# EAGLE design logger (EAGLE 9.6.2)
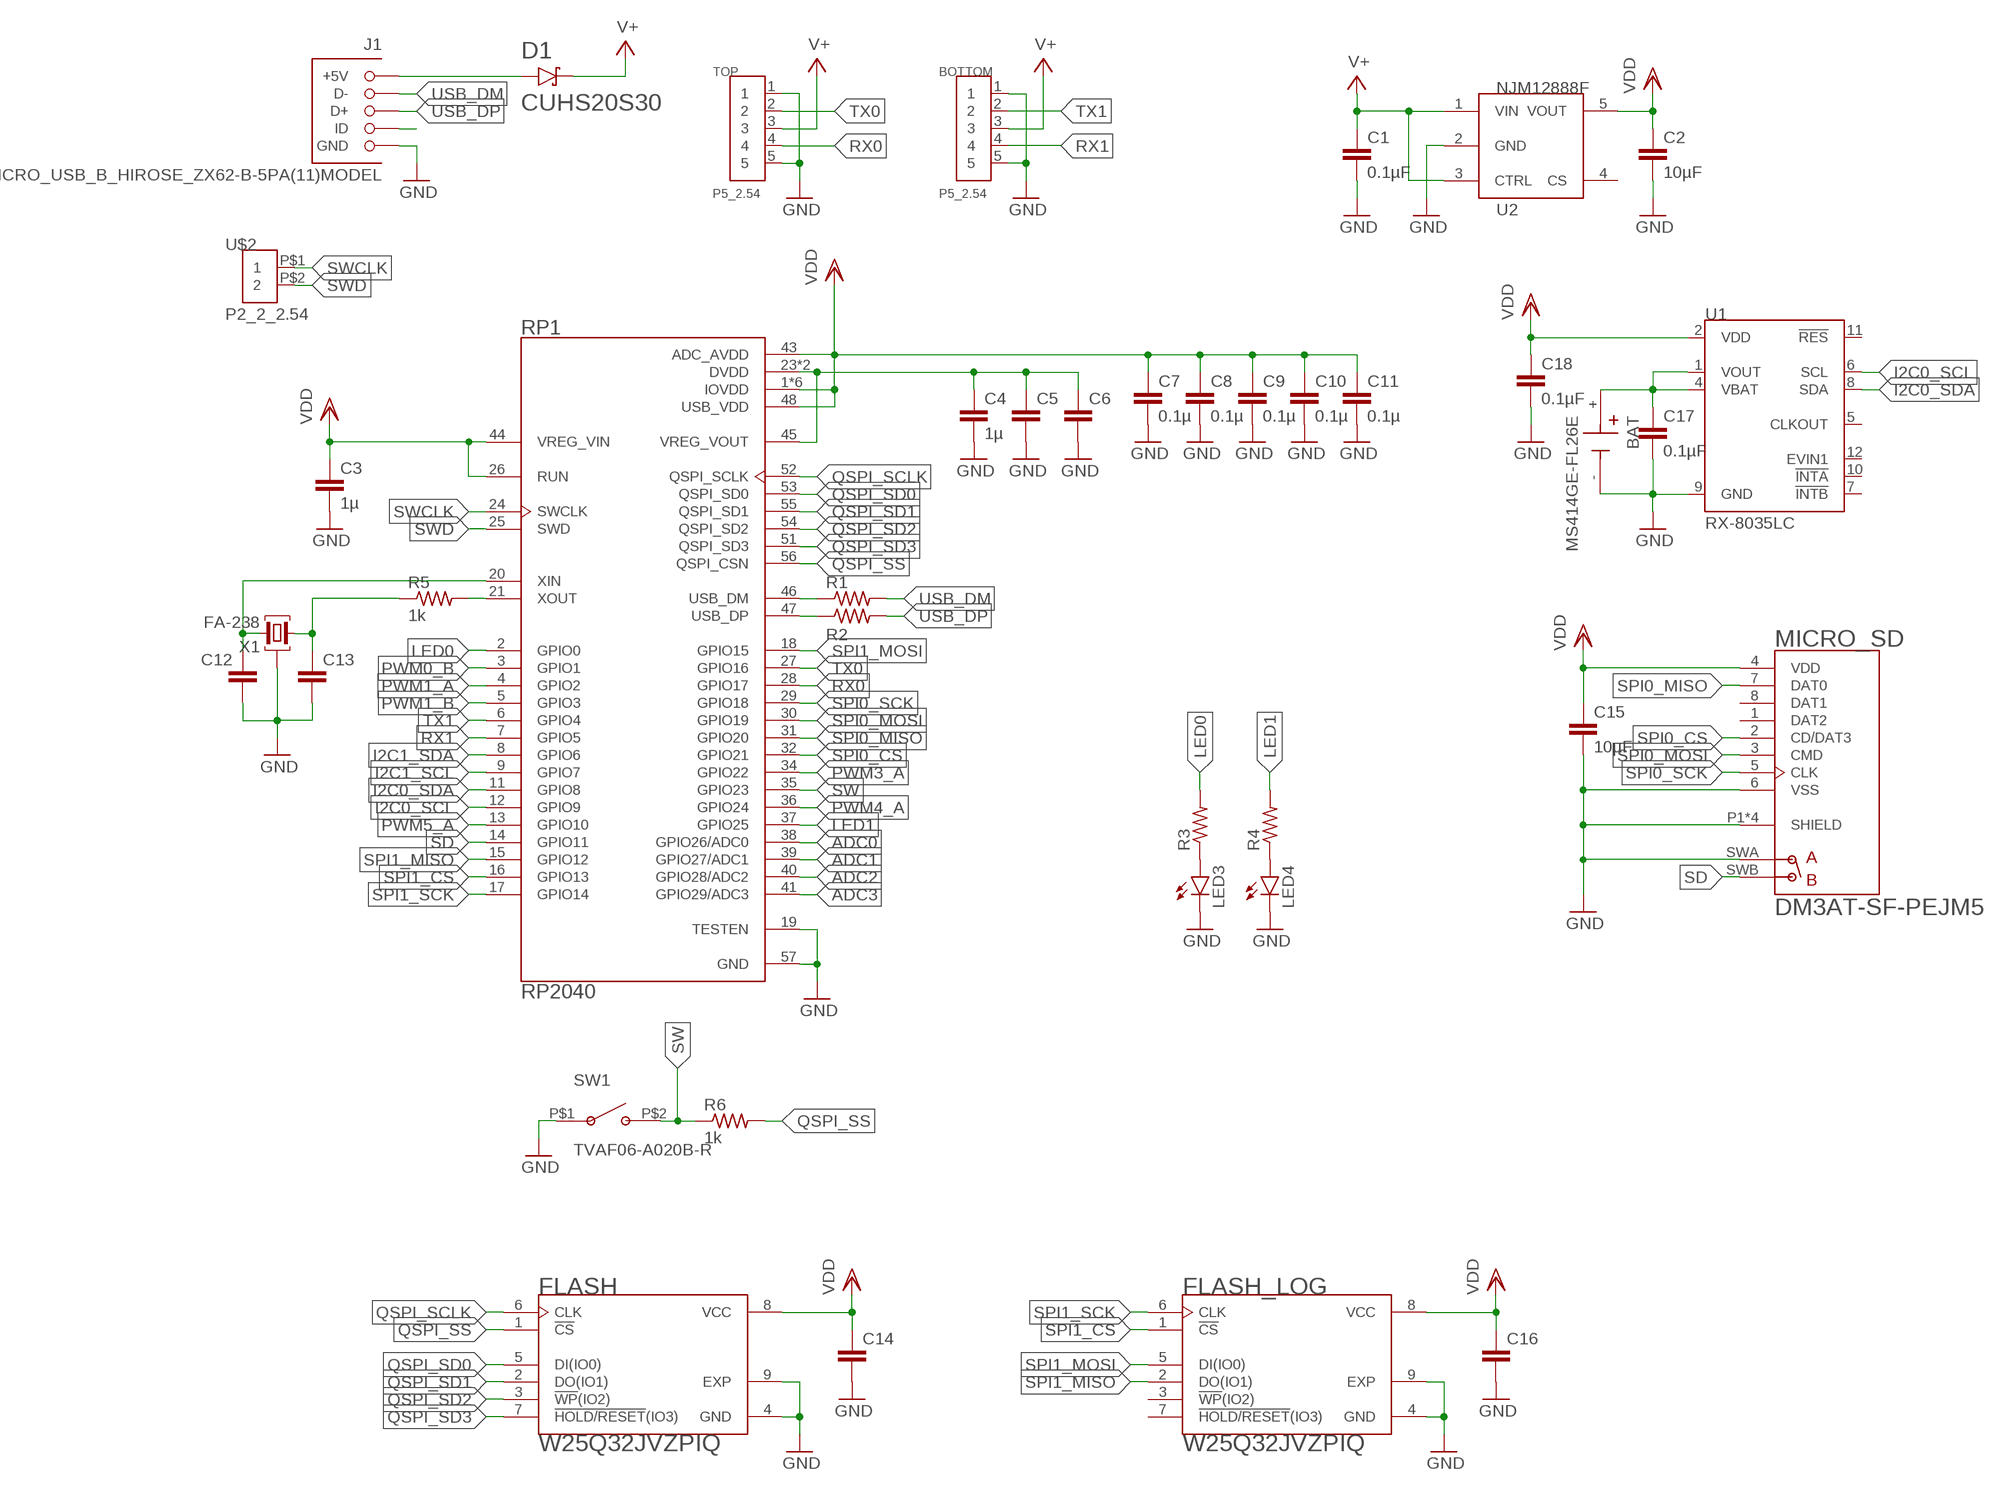
[diagram p0: schematic, sheet 1]

## Parts
BAT  MS414GE-FL26E  [BAT_MS414GE-FL26E]
BOTTOM  P5_2.54  [P5_2.54]
C1  0.1µF  C-EUC0402  [C0402]
C2  10µF  C-EUC0402  [C0402]
C3  1µ  C-EUC0402  [C0402]
C4  1µ  C-EUC0402  [C0402]
C5  C-EUC0402  [C0402]
C6  C-EUC0402  [C0402]
C7  0.1µ  C-EUC0402  [C0402]
C8  0.1µ  C-EUC0402  [C0402]
C9  0.1µ  C-EUC0402  [C0402]
C10  0.1µ  C-EUC0402  [C0402]
C11  0.1µ  C-EUC0402  [C0402]
C12  C-EUC0402  [C0402]
C13  C-EUC0402  [C0402]
C14  C-EUC0402  [C0402]
C15  10µF  C-EUC0402  [C0402]
C16  C-EUC0402  [C0402]
C17  0.1µF  C-EUC0402  [C0402]
C18  0.1µF  C-EUC0402  [C0402]
D1  CUHS20S30  [CUHS20S30]
FLASH  W25Q32JVZPIQ  [SON127P600X500X80-9N]
FLASH_LOG  W25Q32JVZPIQ  [SON127P600X500X80-9N]
J1  MICRO_USB_B_HIROSE_ZX62-B-5PA(11)MODEL  [GHI-CONNECTORS_10118192-0001LF(MICRO-USB-B-AMPHENOL-FCI)]
LED3  LEDCHIPLED_0603  [CHIPLED_0603]
LED4  LEDCHIPLED_0603  [CHIPLED_0603]
MICRO_SD  DM3AT-SF-PEJM5  [HRS_DM3AT-SF-PEJM5]
R1  R-US_R0402  [R0402]
R2  R-US_R0402  [R0402]
R3  R-US_R0402  [R0402]
R4  R-US_R0402  [R0402]
R5  1k  R-US_R0402  [R0402]
R6  1k  R-US_R0402  [R0402]
RP1  RP2040  [QFN40P700X700X90-57N]
SW1  TVAF06-A020B-R  [TVAF06-A020B-R]
TOP  P5_2.54  [P5_2.54]
U1  RX-8035LC  [VSOJ12]
U2  NJM12888F  [SOT95P240X110-5N]
U$2  P2_2_2.54  [P2_2.54]
X1  FA-238  [FA-238]

## Nets
1V2: C4.1 C5.1 C6.1 RP1.23(DVDD) RP1.45(VREG_VOUT) RP1.50(DVDD)
ADC0: RP1.38(GPIO26/ADC0)
ADC1: RP1.39(GPIO27/ADC1)
ADC2: RP1.40(GPIO28/ADC2)
ADC3: RP1.41(GPIO29/ADC3)
GND: BAT.- BOTTOM.1 BOTTOM.5 C1.2 C2.2 C3.2 C4.2 C5.2 C6.2 C7.2 C8.2 C9.2 C10.2 C11.2 C12.2 C13.2 C14.2 C15.2 C16.2 C17.2 C18.2 FLASH.4(GND) FLASH.9(EXP) FLASH_LOG.4(GND) FLASH_LOG.9(EXP) J1.CGND1(GND) J1.CGND2(GND) J1.CGND3(GND) J1.CGND4(GND) J1.CGND5(GND) J1.CGND6(GND) J1.GND LED3.C LED4.C MICRO_SD.6(VSS) MICRO_SD.P1(SHIELD) MICRO_SD.P2(SHIELD) MICRO_SD.P3(SHIELD) MICRO_SD.P4(SHIELD) MICRO_SD.SWA(A) RP1.19(TESTEN) RP1.57(GND) SW1.P$1(A) TOP.1 TOP.5 U1.9(GND) U2.2(GND) X1.2(G) X1.4(G)
I2C0_SCL: RP1.12(GPIO9) U1.6(SCL)
I2C0_SDA: RP1.11(GPIO8) U1.8(SDA)
I2C1_SCL: RP1.9(GPIO7)
I2C1_SDA: RP1.8(GPIO6)
LED0: R3.2 RP1.2(GPIO0)
LED1: R4.2 RP1.37(GPIO25)
N$1: BAT.+ C17.1 U1.1(VOUT) U1.4(VBAT)
N$5: J1.ID
N$6: D1.A J1.VBUS(+5V)
N$8: LED3.A R3.1
N$9: LED4.A R4.1
N$11: C13.1 R5.1 X1.1
PWM0_B: RP1.3(GPIO1)
PWM1_A: RP1.4(GPIO2)
PWM1_B: RP1.5(GPIO3)
PWM3_A: RP1.34(GPIO22)
PWM4_A: RP1.36(GPIO24)
PWM5_A: RP1.13(GPIO10)
QSPI_SCLK: FLASH.6(CLK) RP1.52(QSPI_SCLK)
QSPI_SD0: FLASH.5(DI(IO0)) RP1.53(QSPI_SD0)
QSPI_SD1: FLASH.2(DO(IO1)) RP1.55(QSPI_SD1)
QSPI_SD2: FLASH.3(!WP!(IO2)) RP1.54(QSPI_SD2)
QSPI_SD3: FLASH.7(!HOLD/RESET!(IO3)) RP1.51(QSPI_SD3)
QSPI_SS: FLASH.1(!CS) R6.2 RP1.56(QSPI_CSN)
RX0: RP1.28(GPIO17) TOP.4
RX1: BOTTOM.4 RP1.7(GPIO5)
SD: MICRO_SD.SWB(B) RP1.14(GPIO11)
SPI0_CS: MICRO_SD.2(CD/DAT3) RP1.32(GPIO21)
SPI0_MISO: MICRO_SD.7(DAT0) RP1.31(GPIO20)
SPI0_MOSI: MICRO_SD.3(CMD) RP1.30(GPIO19)
SPI0_SCK: MICRO_SD.5(CLK) RP1.29(GPIO18)
SPI1_CS: FLASH_LOG.1(!CS) RP1.16(GPIO13)
SPI1_MISO: FLASH_LOG.2(DO(IO1)) RP1.15(GPIO12)
SPI1_MOSI: FLASH_LOG.5(DI(IO0)) RP1.18(GPIO15)
SPI1_SCK: FLASH_LOG.6(CLK) RP1.17(GPIO14)
SW: R6.1 RP1.35(GPIO23) SW1.P$2(B)
SWCLK: RP1.24(SWCLK) U$2.P$1
SWD: RP1.25(SWD) U$2.P$2
TX0: RP1.27(GPIO16) TOP.2
TX1: BOTTOM.2 RP1.6(GPIO4)
USB_DM: J1.D- R1.2
USB_DM_1: R1.1 RP1.46(USB_DM)
USB_DP: J1.D+ R2.2
USB_DP_1: R2.1 RP1.47(USB_DP)
V+: BOTTOM.3 C1.1 D1.C TOP.3 U2.1(VIN) U2.3(CTRL)
VDD: C2.1 C3.1 C7.1 C8.1 C9.1 C10.1 C11.1 C14.1 C15.1 C16.1 C18.1 FLASH.8(VCC) FLASH_LOG.8(VCC) MICRO_SD.4(VDD) RP1.1(IOVDD) RP1.10(IOVDD) RP1.22(IOVDD) RP1.26(RUN) RP1.33(IOVDD) RP1.42(IOVDD) RP1.43(ADC_AVDD) RP1.44(VREG_VIN) RP1.48(USB_VDD) RP1.49(IOVDD) U1.2(VDD) U2.5(VOUT)
XIN1: C12.1 RP1.20(XIN) X1.3
XOUT1: R5.2 RP1.21(XOUT)
Unconnected: FLASH_LOG.3(!WP!(IO2)) FLASH_LOG.7(!HOLD/RESET!(IO3)) MICRO_SD.1(DAT2) MICRO_SD.8(DAT1) U1.5(CLKOUT) U1.7(!INTB!) U1.10(!INTA!) U1.11(!RES!) U1.12(EVIN1) U2.4(CS)

## Library data of the parts
BAT = MS414GE-FL26E:MS414GE-FL26E: Coin, 4.8mm 3V Lithium Battery Rechargeable (Secondary) 2mAh Check availability <https://pricing.snapeda.com/parts/MS414GE-FL26E/Seiko/view-part?ref=eda>; AVAILABILITY: In Stock; DESCRIPTION: Coin, 4.8mm 3 V Lithium Battery Rechargeable (Secondary) 2mAh; MF: Seiko; MP: MS414GE-FL26E; PACKAGE: Custom Package Seiko; PRICE: None; PURCHASE-URL: https://pricing.snapeda.com/search/part/MS414GE-FL26E/?ref=eda
BOTTOM TOP = pins:P5_2.54
C1-C18 = rcl:C-EU: CAPACITOR, European symbol; SPICEPREFIX: C
D1 = diodes:CUHS20S30
FLASH FLASH_LOG = W25Q32JVZPIQ:W25Q32JVZPIQ: Serial Flash Memory With Dual, Quad Spi Check availability <https://pricing.snapeda.com/parts/W25Q32JVZPIQ/Winbond/view-part?ref=eda>; AVAILABILITY: In Stock; DESCRIPTION: FLASH - NOR Memory IC 32Mb (4M x 8) SPI - Quad I/O 133 MHz 8-WSON (6x5); MF: Winbond; MP: W25Q32JVZPIQ; PACKAGE: WSON-8 Winbond; PRICE: None; PURCHASE-URL: https://pricing.snapeda.com/search/part/W25Q32JVZPIQ/?ref=eda
J1 = connector:MICRO_USB_B_HIROSE_ZX62-B-5PA(11): Connector Receptacle USB - micro B 2.0 5 Position Surface Mount, Right Angle, Horizontal Bottom Mount
LED3 LED4 = led:LED: LED OSRAM: - CHIPLED LG R971, LG N971, LY N971, LG Q971, LY Q971, LO R971, LY R971 LH N974, LH R974 LS Q976, LO Q976, LY Q976 LO Q996 - Hyper CHIPLED LW Q18S LB Q993, LB Q99A, LB R99A - SideLED LS A670, LO A670, LY A670, LG A670, LP A670 LB A673, LV A673, LT A673, LW A673 LH A674 LY A675 LS A676, LA A676, LO A676, LY A676, LW A676 LS A679, LY A679, LG A679 - Hyper Micro SIDELED® LS Y876, LA Y876, LO Y876, LY Y876 LT Y87S - SmartLED LW L88C, LW L88S LB L89C, LB L89S, LG L890 LS L89K, LO L89K, LY L89K LS L896, LA L896, LO L896, LY L896 - TOPLED LS T670, LO T670, LY T670, LG T670, LP T670 LSG T670, LSP T670, LSY T670, LOP T670, LYG T670 LG T671, LOG T671, LSG T671 LB T673, LV T673, LT T673, LW T673 LH T674 LS T676, LA T676, LO T676, LY T676, LB T676, LH T676, LSB T676, LW T676 LB T67C, LV T67C, LT T67C, LS T67K, LO T67K, LY T67K, LW E67C LS E67B, LA E67B, LO E67B, LY E67B, LB E67C, LV E67C, LT E67C LW T67C LS T679, LY T679, LG T679 LS T770, LO T770, LY T770, LG T770, LP T770 LB T773, LV T773, LT T773, LW T773 LH T774 LS E675, LA E675, LY E675, LS T675 LS T776, LA T776, LO T776, LY T776, LB T776 LHGB T686 LT T68C, LB T68C - Hyper Mini TOPLED® LB M676 - Mini TOPLED Santana® LG M470 LS M47K, LO M47K, LY M47K Source: http://www.osram.convergy.de LUXEON: - LUMILED® LXK2-PW12-R00, LXK2-PW12-S00, LXK2-PW14-U00, LXK2-PW14-V00 LXK2-PM12-R00, LXK2-PM12-S00, LXK2-PM14-U00 LXK2-PE12-Q00, LXK2-PE12-R00, LXK2-PE12-S00, LXK2-PE14-T00, LXK2-PE14-U00 LXK2-PB12-K00, LXK2-PB12-L00, LXK2-PB12-M00, LXK2-PB14-N00, LXK2-PB14-P00, LXK2-PB14-Q00 LXK2-PR12-L00, LXK2-PR12-M00, LXK2-PR14-Q00, LXK2-PR14-R00 LXK2-PD12-Q00, LXK2-PD12-R00, LXK2-PD12-S00 LXK2-PH12-R00, LXK2-PH12-S00 LXK2-PL12-P00, LXK2-PL12-Q00, LXK2-PL12-R00 Source: www.luxeon.com KINGBRIGHT: KA-3528ASYC Source: www.kingbright.com
MICRO_SD = dm3at-sf-pejm5:DM3AT-SF-PEJM5: DM3 Series 8 Position Right Angle SMT Push Push Ejection MicroSD Card Connector; DESCRIPTION: DM3 RA SMT microSD memory card push/push; DIGI-KEY_PART_NUMBER: HR1964CT-ND; DIGI-KEY_PURCHASE_URL: https://www.digikey.jp/product-detail/en/hirose-electric-co-ltd/DM3AT-SF-PEJM5/HR1964CT-ND/2533566?utm_source=snapeda&utm_medium=aggregator&utm_campaign=symbol; MF: Hirose; MP: DM3AT-SF-PEJM5; PACKAGE: None
R1-R6 = rcl:R-US_: RESISTOR, American symbol; SPICEPREFIX: R
RP1 = RP2040:RP2040: Check availability <https://pricing.snapeda.com/parts/RP2040/Raspberry%20Pi/view-part?ref=eda>; AVAILABILITY: In Stock; DESCRIPTION: RP2040 chip for Raspberry Pi Pico - ARM® Cortex®-M0+ MCU 32-Bit; MF: Raspberry Pi; MP: RP2040; PACKAGE: None; PRICE: None; PURCHASE-URL: https://pricing.snapeda.com/search/part/RP2040/?ref=eda
SW1 = switches:TVAF06-A020B-R
U1 = rtc:RX-8035LC
U2 = regulators:NJM12888F
U$2 = pins:P2_2_2.54
X1 = crystal':FA-238: CRYSTAL

## Board
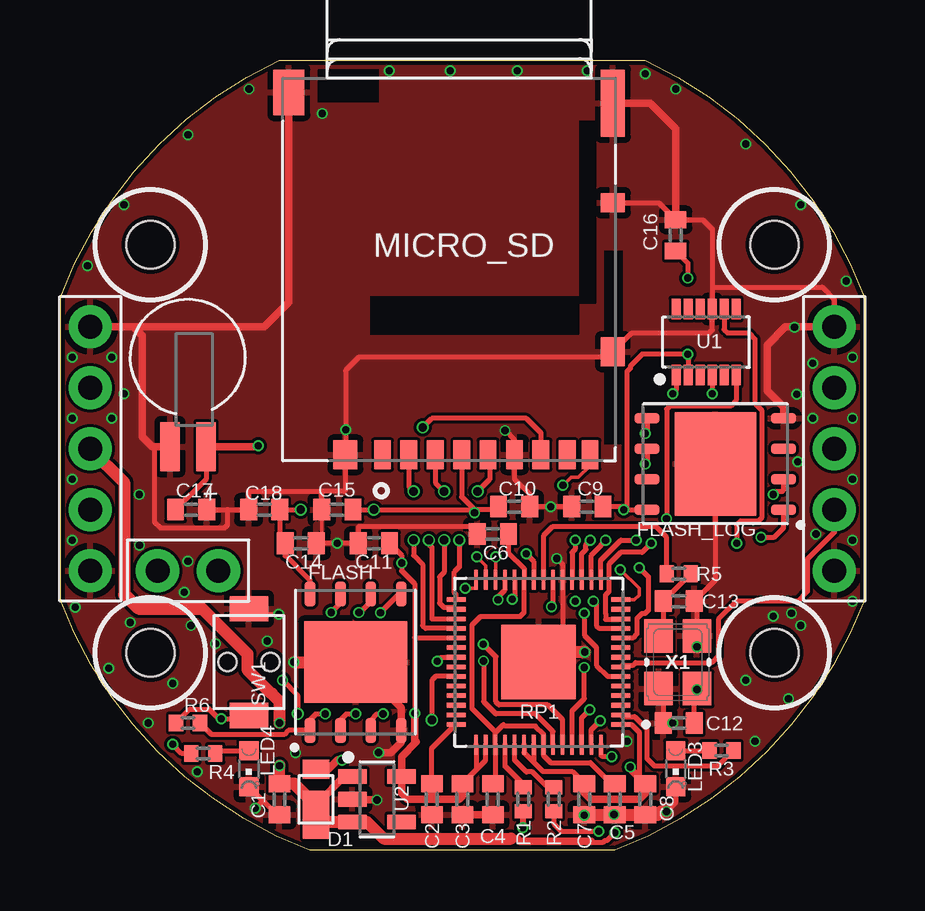
[diagram p1: board, top side]
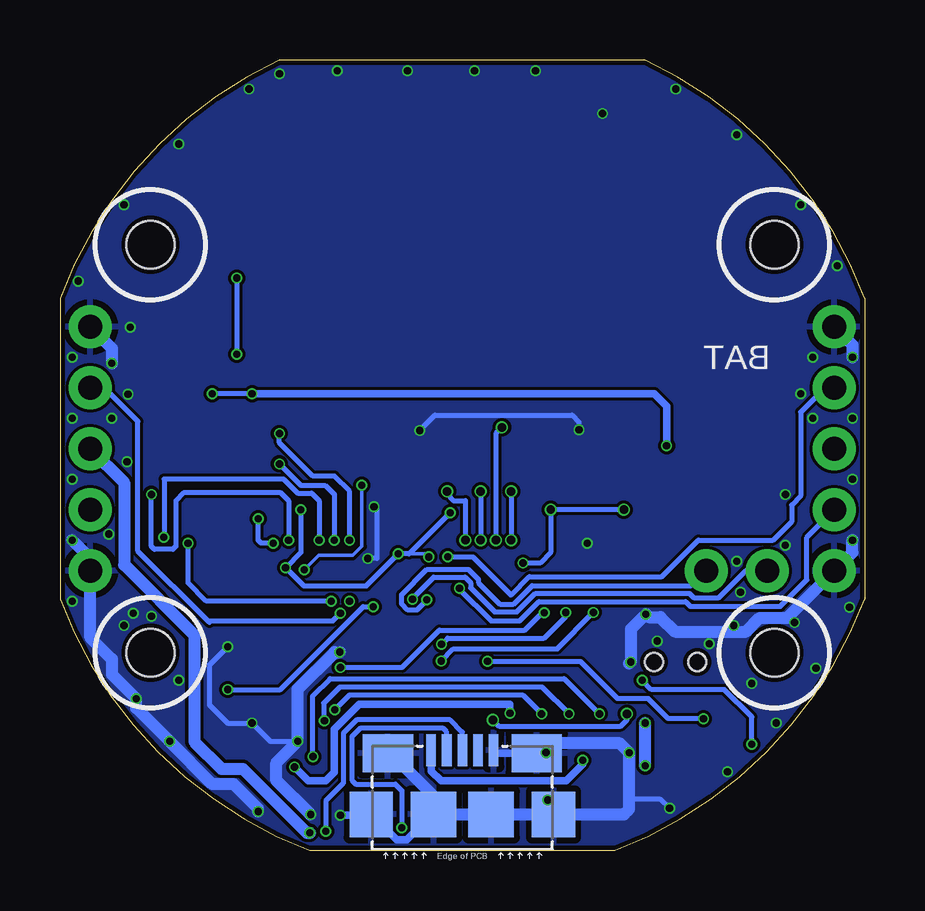
[diagram p2: board, bottom side, seen from below]

Size 33.53 x 32.93 mm. Coordinates in mm from the lower left corner, seen from the top.
Outline: 33.53,23.01 33.53,10.46 arc-49 23.11,0 10.41,0 arc-49 0,10.46 0,23.01 arc-44 9.14,32.93 24.38,32.93 arc-44 33.53,23.01
Copper layers (1*16): Top 0.035mm / dielectric 1mm / Bottom 0.035mm
Design rules "jlcpcb-2layers-1.0mm": minimum track width 5mil, minimum drill 0.3mm, track to track 5mil, track to pad 5mil, pad to pad 5mil, via to via 5mil, smd to smd 5mil, copper to edge 0.2mm, drill to drill 6mil, minimum pad ring 10mil, minimum via ring 3mil, stop-mask expansion 4mil, vias tented up to drill 1mm, thermal gap 10mil
Holes 2 mm at 29.76,25.24 29.76,8.24 3.76,25.24 3.76,8.24

### Footprints (pad centres in the part's own frame; a part is rotated, then mirrored left to right if it is on the bottom)
BAT_MS414GE-FL26E = smd 2.05 x 0.8: + 3.725,0.75; - 3.725,-0.75
P5_2.54 = drill 1: 1 0,5.08; 2 0,2.54; 3 0,0; 4 0,-2.54; 5 0,-5.08
C0402 = smd 0.7 x 0.9: 1 -0.65,0; 2 0.65,0
CUHS20S30 = smd 0.8 x 1.1: A 1.25,0 | smd 2 x 1.1: C -0.65,0
SON127P600X500X80-9N = smd 1.04 x 0.44: 1 -2.845,1.905; 2 -2.845,0.635; 3 -2.845,-0.635; 4 -2.845,-1.905; 5 2.845,-1.905; 6 2.845,-0.635; 7 2.845,0.635; 8 2.845,1.905 | smd 3.4 x 4.3: 9 0,0
GHI-CONNECTORS_10118192-0001LF(MICRO-USB-B-AMPHENOL-FCI) = smd 1.8 x 1.9: CGND1 -3.8,0; CGND4 3.8,0 | smd 1.9 x 1.9: CGND2 -1.2,0; CGND3 1.2,0 | smd 2.1 x 1.6: CGND5 3.1,2.55; CGND6 -3.1,2.55 | smd 0.4 x 1.35: D+ 0,2.675; D- -0.65,2.675; GND 1.3,2.675; ID 0.65,2.675; VBUS -1.3,2.675
CHIPLED_0603 = smd 0.8 x 0.8: A 0,-0.75; C 0,0.75
HRS_DM3AT-SF-PEJM5 = smd 0.7 x 1.2: 1 3.2,0; 2 2.1,0; 3 1,0; 4 -0.1,0; 5 -1.2,0; 6 -2.3,0; 7 -3.4,0; 8 -4.5,0; SWB -5.45,0 | smd 1 x 1.2: P1 -6.4,-4.3; P4 4.75,0 | smd 1 x 2.8: P2 -6.4,-14.65 | smd 1.3 x 1.9: P3 7.1,-15.1 | smd 1 x 0.8: SWA -6.4,-10.5
R0402 = smd 0.6 x 0.7: 1 -0.5,0; 2 0.5,0
QFN40P700X700X90-57N = smd 0.84 x 0.2: 1 -3.435,2.6; 2 -3.435,2.2; 3 -3.435,1.8; 4 -3.435,1.4; 5 -3.435,1; 6 -3.435,0.6; 7 -3.435,0.2; 8 -3.435,-0.2; 9 -3.435,-0.6; 10 -3.435,-1; 11 -3.435,-1.4; 12 -3.435,-1.8; 13 -3.435,-2.2; 14 -3.435,-2.6; 29 3.435,-2.6; 30 3.435,-2.2; 31 3.435,-1.8; 32 3.435,-1.4; 33 3.435,-1; 34 3.435,-0.6; 35 3.435,-0.2; 36 3.435,0.2; 37 3.435,0.6; 38 3.435,1; 39 3.435,1.4; 40 3.435,1.8; 41 3.435,2.2; 42 3.435,2.6 | smd 0.2 x 0.84: 15 -2.6,-3.435; 16 -2.2,-3.435; 17 -1.8,-3.435; 18 -1.4,-3.435; 19 -1,-3.435; 20 -0.6,-3.435; 21 -0.2,-3.435; 22 0.2,-3.435; 23 0.6,-3.435; 24 1,-3.435; 25 1.4,-3.435; 26 1.8,-3.435; 27 2.2,-3.435; 28 2.6,-3.435; 43 2.6,3.435; 44 2.2,3.435; 45 1.8,3.435; 46 1.4,3.435; 47 1,3.435; 48 0.6,3.435; 49 0.2,3.435; 50 -0.2,3.435; 51 -0.6,3.435; 52 -1,3.435; 53 -1.4,3.435; 54 -1.8,3.435; 55 -2.2,3.435; 56 -2.6,3.435 | smd 3.1 x 3.1: 57 0,0
TVAF06-A020B-R = smd 1.6 x 1.05: P$1 0,2.225; P$2 0,-2.225 | hole 0.75: -0.9,0; 0.9,0
VSOJ12 = smd 0.862 x 0.372: 1 -1.375,1.25; 2 -1.375,0.75; 3 -1.375,0.25; 4 -1.375,-0.25; 5 -1.375,-0.75; 6 -1.375,-1.25; 7 1.375,-1.25; 8 1.375,-0.75; 9 1.375,-0.25; 10 1.375,0.25; 11 1.375,0.75; 12 1.375,1.25
SOT95P240X110-5N = smd 1.18 x 0.609: 1 -1.024,0.95; 2 -1.024,0; 3 -1.024,-0.95; 4 1.024,-0.95; 5 1.024,0.95
P2_2.54 = drill 1: P$1 0,1.27; P$2 0,-1.27
FA-238 = smd 1.4 x 1.2: 1 -1.1,-0.8; 2 1.1,-0.8; 3 1.1,0.8; 4 -1.1,0.8

### Placement (x,y rotation side)
BAT  5.33,20.55 270 top
BOTTOM  32.26,16.74 0 top
C1  9.14,2.13 270 top
C2  15.49,2.13 270 top
C3  16.76,2.13 270 top
C4  18.03,2.13 270 top
C5  23.11,2.13 270 top
C6  18.03,13.18 180 top
C7  21.84,2.13 270 top
C8  24.38,2.13 270 top
C9  21.97,14.32 180 top
C10  18.92,14.32 0 top
C11  13.08,12.8 180 top
C12  25.78,5.31 180 top
C13  25.78,10.39 0 top
C14  10.03,12.8 0 top
C15  11.56,14.2 180 top
C16  25.65,25.63 90 top
C17  5.46,14.2 0 top
C18  8.51,14.2 180 top
D1  10.67,2.13 90 top
FLASH  12.32,7.85 90 top
FLASH_LOG  27.3,16.1 180 top
J1  16.76,1.5 0 bottom
LED3  25.65,3.4 180 top
LED4  7.87,3.4 180 top
MICRO_SD  16.64,16.48 180 top
R1  19.3,2.13 270 top
R2  20.57,2.13 270 top
R3  27.56,4.16 0 top
R4  5.97,4.04 180 top
R5  25.78,11.53 180 top
R6  5.33,5.31 0 top
RP1  19.94,7.85 180 top
SW1  7.87,7.85 0 top
TOP  1.26,16.74 0 top
U1  26.92,21.18 90 top
U2  13.21,2.13 0 top
U$2  5.33,11.66 90 top
X1  25.74,7.84 270 top

### Tracks (layer width: path | path; a pad name or v marks a point on that pad's centre or on a via)
1V2
  Top 0.2: C4.1 18.14,2.89 RP1.45 18.14,4.9 18.16,4.92 | C5.1 22.97,2.78 22.1,3.65 20.45,3.65 20.14,3.96 RP1.50 20.14,4.85 19.81,5.18 18.54,5.18 18.48,5.24 18.16,4.92 | 18.16,4.92 17.18,5.91 17.18,9.4 17.53,9.75 19.18,9.75 19.34,9.91 RP1.23 19.34,11.75 18.68,12.4 C6.1
GND  (via drill 0.3)
  Top 0.152: C15.2 10.91,13.02 C14.2
  Top 0.2: 19.54,14.29 C10.2 | C11.2 C14.2 | C11.2 v11.56,12.8 | C11.2 12.43,13.48 17.22,13.48 17.39,13.31 17.39,13.19 C6.2 17.4,13.19 | RP1.57 20.94,8.85 RP1.19 20.94,11.93 v20.7,12.16 | SW1.P$1 8.1,9.84 v9.12,9.84 | LED4.C 8.45,2.07 | 8.45,2.07 9.04,1.48 C1.2 | LED3.C 25.65,2 v25.27,1.62 | X1.2 25.13,6.55 C12.2 v25.53,5.31 | v26.54,8.48 X1.4 26.54,10.28 C13.2 27.3,11.26 FLASH_LOG.9 | C17.2 6.98,14.2 | 6.98,14.2 C18.2 7.86,14.96 10.91,14.96 | MICRO_SD.P4 11.89,16.35 | 11.89,16.35 11.89,15.01 11.84,14.96 10.91,14.96 | 8.45,2.07 v8.13,1.75 | MICRO_SD.SWA 24.95,26.98 C16.2 26.78,26.28 27.18,25.88 27.18,23.47 | 27.18,23.47 U1.9 27.18,21.69 27.03,21.54 23.8,21.54 MICRO_SD.P1 22.8,20.55 12.45,20.55 11.9,20 v11.9,17.53 11.9,16.37 11.89,16.35 | 27.18,23.47 31.75,23.47 32.26,22.95 BOTTOM.1 | C10.2 19.57,14.83 18.94,15.47 MICRO_SD.6 18.94,17.1 v18.54,17.5 | 10.65,13.94 C15.2 10.91,14.96 | C10.2 v20.45,14.32 C9.2 | 3.85,16.82 3.94,16.74 3.94,13.69 4.19,13.43 6.86,13.43 6.98,13.56 6.98,14.2
  Top 0.305: FLASH.9 14.22,5.94 FLASH.4 14.22,4.51 13.79,4.07 v13.27,4.07 | v13.21,2.1 12.21,2.1 U2.2 | C7.2 v21.84,1.46 | C4.2 C3.2 | BAT.- 3.85,16.82 3.43,17.24 3.43,21.43 3.05,21.82 | 3.05,21.82 TOP.1 | MICRO_SD.P3 9.54,22.84 8.51,21.82 3.05,21.82 | MICRO_SD.P2 24.59,31.13 25.65,30.07 C16.2 | FLASH_LOG.9 27.3,16.99 | BOTTOM.1 30.23,21.82 29.46,21.05 29.46,19.15 30.15,18.46 FLASH_LOG.4
  Top 0.508: v9.74,7.85 FLASH.9 | C7.2 C5.2 C8.2 24.89,1.48 25.04,1.62 v25.27,1.62 | RP1.57 20.35,8.26 v21.87,8.26
  Bottom 0.2: J1.CGND2 17.65,1.5 | v23.62,4.54 24.77,4.54 v25.53,5.31 26.54,5.31 27.3,6.07 27.3,7.72 v26.54,8.48 | v8.13,1.75 8.51,2.13 9.81,2.13 | v20.45,14.32 20.32,14.2 20.32,12.16 v20.7,12.16 | v18.54,17.5 17.91,18.13 12.19,18.13 11.9,17.85 v11.9,17.53
  Bottom 0.305: J1.CGND4 13.21,1.74 v13.21,2.1 | J1.GND 15.34,4.05 J1.CGND5 | v21.84,1.46 20.59,1.46 J1.CGND1 20.55,1.5 19.5,0.44 19.08,0.44 18.02,1.5
  Bottom 0.508: J1.CGND6 19.75,4.05 17.96,2.26 J1.CGND2 18.02,1.5 | 17.65,1.5 J1.CGND3 J1.CGND4 10.03,1.5 9.81,1.72 9.81,2.13 v9.81,4.07 10.2,4.46 13.25,4.46 J1.CGND5 | 9.81,7.78 v9.74,7.85 9.74,9.21 v9.12,9.84 | v25.27,1.62 25.27,1.74 26.3,2.77 27.18,2.77 v28.96,4.54 30.35,5.94 v30.35,6.32 31.37,7.34 31.37,7.97 32.26,8.86 BOTTOM.5 32.26,12.17 v33.02,12.93 | v23.08,1.49 v23.09,1.5 23.11,1.5 24.51,2.9 24.51,3.65 v23.62,4.54 23.62,6.73 22.09,8.26 v21.87,8.26 | v9.12,9.84 9.12,9.81 9.09,9.78 | BOTTOM.1 31.37,20.92 v31.37,20.29 | TOP.1 0.51,21.06 v0.51,20.55 | v0.51,12.93 0.51,12.41 TOP.5 3.23,9.69 4.37,9.69 4.94,9.12 7.9,9.12 8.51,9.72 9,9.72 v9.12,9.84
  other vias: 33.02,10.39 33.02,20.55 5.33,29.82 32.77,23.72 30.86,26.9 28.57,29.44 25.65,31.72 24.38,32.36 21.97,32.48 19.05,32.48 16.26,32.48 13.72,32.48 10.92,30.71 7.87,31.72 2.67,26.9 1.14,24.36 0.51,18.01 0.51,15.47 0.63,10.13 2.03,7.59 3.68,5.31 4.7,6.96 29.72,9.75 33.02,15.47 33.02,18.01 31.37,18.01 30.73,16.2 31.5,13.18 30.48,9.88 30.86,9.37 28.57,7.08 5.71,3.27 8.64,8.72 6.48,8.61 2.67,19.02 3.3,14.83 2.92,9.5 3.31,12.71 5.46,9.37 2.16,20.55 2.16,18.01 30.7,19.01 30.6,21.79 5.33,12.04 5.17,10.75
  pour Top: -6.1,37.06 38.35,37.06 38.35,-3.58 -6.1,-3.58
  pour Bottom: -7.37,44.68 42.16,44.68 42.16,-6.12 -7.37,-6.12
  pour Bottom: -2.54,40.61 -2.54,-1.17 -1.02,-2.7 36.58,-2.7 38.35,-0.92 38.35,39.72 37.72,40.36 -2.29,40.36
I2C0_SCL  (via drill 0.3)
  Top 0.2: U1.6 28.17,18.75 27.94,18.51 25.4,18.51 25.27,18.39 v25.27,13.81 | v24.64,12.8 24.26,12.42 23.37,12.42 22.87,11.92 22.87,10.78 22.73,10.65 22.73,10.63 22.73,10.62 22.73,9.87 22.73,9.86 22.73,9.62 23.35,9.62 RP1.12
  Bottom 0.2: v24.64,12.8 25.15,12.8 25.27,12.93 v25.27,13.81
I2C0_SDA  (via drill 0.3)
  Top 0.2: U1.8 27.67,21.7 27.81,21.56 28.7,21.56 28.96,21.31 28.96,18.62 29.23,18.34 29.23,13.86 29.1,13.72 28.36,13.72 28.19,13.56 v28.19,12.8 | v22.23,10.39 22.35,10.26 22.35,9.37 22.48,9.25 RP1.11
  Bottom 0.2: v22.23,10.39 27.43,10.39 28.19,11.15 v28.19,12.8
LED0
  Top 0.2: RP1.2 23.45,5.57 23.94,5.57 24.46,5.06 24.46,3.84 24.77,3.52 27.42,3.52 R3.2
LED1  (via drill 0.3, 0.35)
  Top 0.2: RP1.37 15.65,7.25 15.49,7.09 v15.49,5.43 | R4.2 5.08,4.04 v4.7,4.42 | v9.27,7.08 9.91,6.45 v9.91,5.69
  Bottom 0.2: v4.7,4.42 4.7,5.56 5.84,6.7 8.89,6.7 v9.27,7.08 | v15.49,5.43 15.24,5.18 10.16,5.18 9.91,5.43 v9.91,5.69
N$1  (via drill 0.3)
  Top 0.2: BAT.+ 6.08,15.47 C17.1 | U1.1 25.67,19.17 v25.53,19.02 | U1.4 v27.17,19.03 v27.18,19.02
  Top 0.305: BAT.+ 8.21,16.82 v8.25,16.86
  Bottom 0.2: v25.53,19.02 v27.18,19.02
  Bottom 0.305: v8.25,16.86 8.25,18.51 8.76,19.02 v25.53,19.02
N$6  (via drill 0.3)
  Top 0.305: D1.A 11.19,3.38 11.58,3.77 11.73,3.77 v11.75,3.75
  Bottom 0.305: J1.VBUS 18.06,3.3 17.65,2.89 12.44,2.89 11.75,3.58 v11.75,3.75
N$8
  Top 0.2: LED3.A 27.05,4.15 R3.1
N$9
  Top 0.2: R4.1 6.58,4.15 LED4.A
N$11
  Top 0.2: R5.1 C13.1 25.13,9.13 X1.1
N$12  (via drill 0.3)
  other vias: 21.46,10.39
QSPI_SCLK  (via drill 0.3)
  Top 0.2: RP1.52 20.94,5.45 20.32,6.07 18.29,6.07 18.16,6.19 18.16,8.07 v17.64,8.59 v17.63,8.59 | v12.45,9.91 12.5,9.91 12.95,10.37 FLASH.6
  Bottom 0.2: v17.63,8.59 17.38,8.84 13.35,8.84 12.45,9.74 v12.45,9.91
QSPI_SD0  (via drill 0.3)
  Top 0.2: RP1.53 21.34,5.82 21.84,6.32 v21.84,7.62 | FLASH.5 14.14,10.69 v13.35,9.9
  Bottom 0.2: v21.84,7.62 19.27,7.62 17.72,9.18 14.16,9.18 13.44,9.9 v13.35,9.9
QSPI_SD1  (via drill 0.3)
  Top 0.2: RP1.55 22.14,5.03 v22.51,5.4 | FLASH.2 11.68,5.43 11.94,5.69 v12.32,5.69
  Bottom 0.2: v22.51,5.4 22.54,5.43 22.54,6.13 21.86,6.81 13.45,6.81 v12.32,5.69
QSPI_SD2  (via drill 0.3)
  Top 0.2: RP1.54 21.74,5.52 v22.08,5.86 | FLASH.3 12.95,5.43 13.21,5.69 v13.46,5.69
  Bottom 0.2: v22.08,5.86 v22.08,5.87 21.46,6.48 14.25,6.48 v13.46,5.69
QSPI_SD3  (via drill 0.3)
  Top 0.2: RP1.51 20.54,4.96 19.81,5.69 18.16,5.69 17.65,6.2 v17.65,7.89 | v11.3,9.91 11.68,10.29 FLASH.7
  Bottom 0.2: v17.65,7.89 17.14,8.4 12.83,8.4 12.83,8.39 v11.3,9.91
QSPI_SS  (via drill 0.3)
  Top 0.2: RP1.56 22.54,3.98 22.61,3.91 v22.99,3.91 | R6.2 6.31,4.82 9.34,4.82 9.52,5 FLASH.1 10.41,5.43 10.67,5.69 v11.05,5.69
  Bottom 0.2: v22.99,3.91 22.99,6.45 22.27,7.16 12.52,7.16 v11.05,5.69
RX0  (via drill 0.3)
  Top 0.152: RP1.28 17.34,10.92 v16.88,10.92
  Bottom 0.2: v16.88,10.92 16.88,10.89 15.56,9.56 14.38,9.56 13.58,10.37 7.46,10.37 7.26,10.17 3.52,10.17 2.41,11.27 2.41,13.04 TOP.4
RX1
  Top 0.2: RP1.7 23.45,7.72 23.87,7.72 23.98,7.83 27.15,7.83 27.43,8.11 27.43,9.62 28.19,10.39 30.73,10.39 31.14,10.79 31.14,12.12 32.26,13.25 BOTTOM.4
SD  (via drill 0.3)
  Top 0.152: RP1.14 23.94,10.45 24.13,10.64 24.13,10.91 v23.35,11.7 | v20.95,15.21 21.29,15.55 21.6,15.55 22.09,16.04 MICRO_SD.SWB
  Bottom 0.152: v23.35,11.7 22.75,12.29 21.34,12.29 20.95,12.67 v20.95,15.21
SPI0_CS  (via drill 0.35)
  Top 0.2: RP1.32 15.24,9.25 15.11,9.37 15.11,11.91 14.73,12.29 v14.73,12.93 | MICRO_SD.2 14.54,15.15 v14.73,14.96
  Bottom 0.2: v14.73,14.96 v14.73,12.93
SPI0_MISO  (via drill 0.35)
  Top 0.2: RP1.31 15.49,9.65 15.49,12.63 15.37,12.75 v15.37,12.93 | v15.11,17.62 15.49,18.01 19.43,18.01 20.04,17.4 MICRO_SD.7
  Bottom 0.2: v15.11,17.62 15.37,17.37 v15.37,12.93
SPI0_MOSI  (via drill 0.35)
  Top 0.2: RP1.30 16.43,10.12 16,10.12 15.82,10.3 15.82,11.4 16,11.58 v16,12.93 | MICRO_SD.3 15.64,15.32 v16,14.96
  Bottom 0.2: v16,14.96 v16,12.93
SPI0_SCK  (via drill 0.35)
  Top 0.2: RP1.29 16.5,10.66 16.43,10.73 16.43,11.61 16.64,11.81 v16.64,12.93 | v17.4,14.96 17.91,15.47 17.91,16.41 MICRO_SD.5
  Bottom 0.2: v17.4,14.96 17.4,14.83 17.14,14.58 16.64,14.58 v16.64,12.93
SPI1_CS  (via drill 0.3)
  Top 0.2: RP1.16 22.14,12.3 22.55,12.71 22.55,12.74 v22.73,12.93 | FLASH_LOG.1 30.15,13.43 29.77,13.05 v29.21,13.05
  Bottom 0.2: v22.73,12.93 22.73,14.58 23.04,14.88 23.63,14.88 24.21,15.47 29.19,15.47 29.19,13.07 v29.21,13.05
SPI1_MISO  (via drill 0.3)
  Top 0.2: RP1.15 22.54,12.09 23.19,12.74 23.37,12.93 v24,12.93 | FLASH_LOG.2 30.15,15.01 30.1,14.96 29.84,14.96 v29.72,14.83
  Bottom 0.2: v24,12.93 24,14.58 24.32,14.89 28.38,14.89 28.7,14.58 28.7,12.67 28.83,12.54 29.59,12.54 29.72,12.67 v29.72,14.83
SPI1_MOSI  (via drill 0.3)
  Top 0.2: v21.46,12.93 21.46,12.54 21.34,12.42 RP1.18 | FLASH_LOG.5 24.46,17.45 v24.38,17.37
  Bottom 0.2: v21.46,12.93 21.46,14.96 22.1,15.59 22.99,15.59 24.38,16.99 v24.38,17.37
SPI1_SCK  (via drill 0.3)
  Top 0.2: RP1.17 21.74,12.36 21.92,12.54 21.92,12.74 v22.1,12.93 | FLASH_LOG.6 24.46,16.18 v24.38,16.1
  Bottom 0.2: v24.38,16.1 23.49,15.21 22.48,15.21 22.1,14.83 v22.1,12.93
SW  (via drill 0.3)
  Top 0.2: R6.1 5.41,5.88 6.23,5.88 6.62,5.49 v6.71,5.49 7.74,5.49 SW1.P$2 | RP1.35 15.87,8.04 v15.72,7.88
  Bottom 0.2: v15.72,7.88 11.85,7.88 10.29,6.32 9.02,6.32 8.18,5.49 v6.71,5.49
SWCLK  (via drill 0.3)
  Top 0.2: RP1.24 18.94,10.56 v18.84,10.47
  Bottom 0.2: v18.84,10.47 18.71,10.6 18.71,10.64 17.96,11.38 16.65,11.38 16.42,11.15 16.42,10.94 15.42,9.93 14.49,9.93 13.72,10.71 7.3,10.71 7.13,10.53 6.08,10.53 4.95,11.66 U$2.P$1
SWD  (via drill 0.3)
  Top 0.2: RP1.25 18.53,10.85 18.25,10.57 v18.25,10.45
  Bottom 0.2: v18.25,10.45 18.25,10.41 18.65,10.01 19.03,10.01 19.29,10.28 19.29,10.65 18.24,11.71 16.51,11.71 16.09,11.29 16.09,11.16 15.2,10.26 14.63,10.26 13.86,11.03 7.23,11.03 U$2.P$2
TX0  (via drill 0.3)
  Top 0.152: v17.37,12.23 17.74,11.87 RP1.27
  Bottom 0.2: v17.37,12.23 16.33,12.23 14.73,10.64 13.97,11.4 8.45,11.4 6.93,12.93 3.81,12.93 3.05,13.69 3.05,14.39 2.67,14.77 2.67,18.26 1.65,19.28 TOP.2
TX1  (via drill 0.3)
  Top 0.2: RP1.6 22.82,7.25 22.35,7.72 22.35,8.46 21.84,8.97 v21.84,9.88
  Bottom 0.2: BOTTOM.2 31.69,19.28 30.28,17.87 30.28,12.47 27.37,9.56 | 27.3,9.5 27.37,9.56 | 27.37,9.56 22.16,9.56 v21.84,9.88
USB_DM  (via drill 0.3)
  Top 0.254: R1.2 19.29,1.61 v19.29,0.95
  Bottom 0.2: J1.D- 17.41,4.94 17.55,5.08 21.02,5.08 21.37,4.74 21.37,2.93 21.21,2.77 19.56,2.77 19.29,2.49 v19.29,0.95
USB_DM_1
  Top 0.2: RP1.46 18.54,3.52 19.3,2.76 R1.1
USB_DP  (via drill 0.3)
  Top 0.2: v22.45,0.8 20.89,0.8 20.57,1.11 R2.2
  Bottom 0.2: J1.D+ 16.76,4.92 17.27,5.43 21.17,5.43 21.72,4.88 21.72,2.8 22.45,2.07 v22.45,0.8
USB_DP_1
  Top 0.2: R2.1 20.51,2.7 20.25,2.7 19.68,3.27 19.43,3.27 18.94,3.77 RP1.47
V+  (via drill 0.3)
  Top 0.2: v23.12,0.73 22.8,0.42 22.71,0.42 22.64,0.34 22.2,0.34 22.16,0.39 22.15,0.39
  Top 0.305: D1.C 10.78,1.59 10.78,2.02 11.84,3.08 U2.1 | 18.8,0.49 19.06,0.49 19.17,0.39 22.15,0.39
  Top 0.508: 18.8,0.49 13.49,0.49 12.8,1.18 U2.3 10.97,1.18 D1.C 10.67,1.86 9.75,2.78 C1.1 v9.14,3.53 | TOP.3 2.67,15.33 2.67,10.67 3.27,10.07 5.92,10.07 7.8,8.19 7.8,7.54 8.81,6.53 8.83,6.53 9.14,6.21 v9.14,5.31
  Bottom 0.508: v23.12,0.73 23.24,0.73 25.91,3.4 26.8,3.4 27.93,4.53 27.93,8.96 30.86,11.9 30.86,15.33 BOTTOM.3 | v9.14,3.53 v9.14,5.31
VDD  (via drill 0.3, 0.35)
  Top 0.152: v18.16,12.23 18.16,11.3 RP1.26
  Top 0.2: RP1.44 17.74,3.76 17.34,3.36 | 17.34,3.36 C3.1 | RP1.42 16.48,5.25 15.49,4.26 C2.1 | RP1.48 19.34,4.07 19.74,3.67 | 19.74,3.67 20.12,3.29 21.34,3.29 C7.1 | RP1.43 17.34,3.36 | 9.38,12.29 C14.1 9.16,13.02 C18.1 v10.03,14.2 | 9.38,12.29 9.38,12.26 | RP1.1 23.81,5.25 24.13,4.92 24.13,3.03 C8.1 | 24.13,11.8 v24.13,11.78 24.51,11.4 24.51,10 24.37,9.86 24.25,9.86 24.04,9.66 24.04,9.03 23.86,8.85 RP1.10 | C11.1 14.23,12.3 v14.23,11.97 | v14.23,11.97 | v17.27,14.07 17.4,14.2 18.15,14.2 C10.1 | RP1.49 19.74,3.67 | MICRO_SD.4 16.74,14.73 17.27,14.2 v17.27,14.07 | C16.1 26.16,24.47 v26.16,23.85 | 23.62,14.2 v23.49,14.2 23.37,14.32 C9.1 | 23.62,14.2 FLASH_LOG.8 | RP1.22 19.74,12.05 v19.43,12.35 | U1.2 26.17,20.66 v26.16,20.67 24.26,20.67 23.76,20.18 23.76,20.09 23.62,19.95 23.62,14.2 | v14.23,11.97 14.23,11.65 14.78,11.11 14.78,8.86 | 14.78,8.86 v14.78,5.71 | 14.78,8.86 14.79,8.85 RP1.33 | v17.27,14.07 17.14,14.2 v13.08,14.2 C15.1 | 9.38,12.29 10.41,11.26 FLASH.8
  Top 0.305: C3.1 16.76,2.26 16.64,2.13 15.49,2.13 | C2.1 15.49,2.13 | C7.1 21.85,2.39 22.11,2.13 24.13,2.13 24.38,2.38 C8.1 23.76,3.41 v23.76,3.47 | 15.49,2.13 14.48,2.13 14.23,2.38 U2.5 14.23,3.91 14.85,4.53 14.78,4.6 v14.78,5.71
  Bottom 0.152: v18.16,12.23 18.29,12.35 19.3,12.35
  Bottom 0.2: v23.49,14.2 23.49,12.42 v24.13,11.78 23.37,11.02 20.77,11.02 v19.43,12.35 19.3,12.35 18.99,12.35 v17.27,14.07 | v26.16,23.85 v26.16,20.67 | v10.03,14.2 v13.08,14.2 13.08,12.42 13.53,11.97 v14.23,11.97
  Bottom 0.305: v23.76,3.47 23.18,2.89 22.46,2.89 22.1,3.26 22.1,4.67 22.1,5.04 21.06,6.08 14.78,6.08 v14.78,5.71
XIN1  (via drill 0.3)
  Top 0.2: v20.48,10.15 20.54,10.21 RP1.20 | C12.1 26.43,6.63 X1.3 v26.54,6.7
  Bottom 0.2: v26.54,6.7 24.34,6.7 20.89,10.15 v20.48,10.15
XOUT1
  Top 0.2: R5.2 25.28,13.04 24.84,13.48 20.51,13.48 20.14,13.1 RP1.21

### Text on the board
bStop: 2022 WASA Rocket | TERES Logger Module